# EAGLE design LidHeater_NTC_withDril (EAGLE 6.5.0)
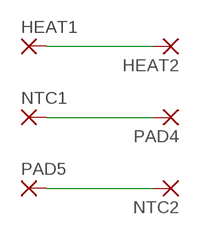
[diagram p0: schematic, sheet 1]

## Parts
HEAT1  SMD5  [SMD2,54-5,08]
HEAT2  SMD5  [SMD2,54-5,08]
NTC1  SMD5  [SMD2,54-5,08]
NTC2  SMD5  [SMD2,54-5,08]
PAD4  SMD5  [SMD2,54-5,08]
PAD5  SMD5  [SMD2,54-5,08]

## Nets
N$1: HEAT1.1(P) HEAT2.1(P)
N$2: NTC1.1(P) PAD4.1(P)
N$3: NTC2.1(P) PAD5.1(P)

## Library data of the parts
HEAT1 HEAT2 NTC1 NTC2 PAD4 PAD5 = wirepad:SMD5: SMD PAD

## Board
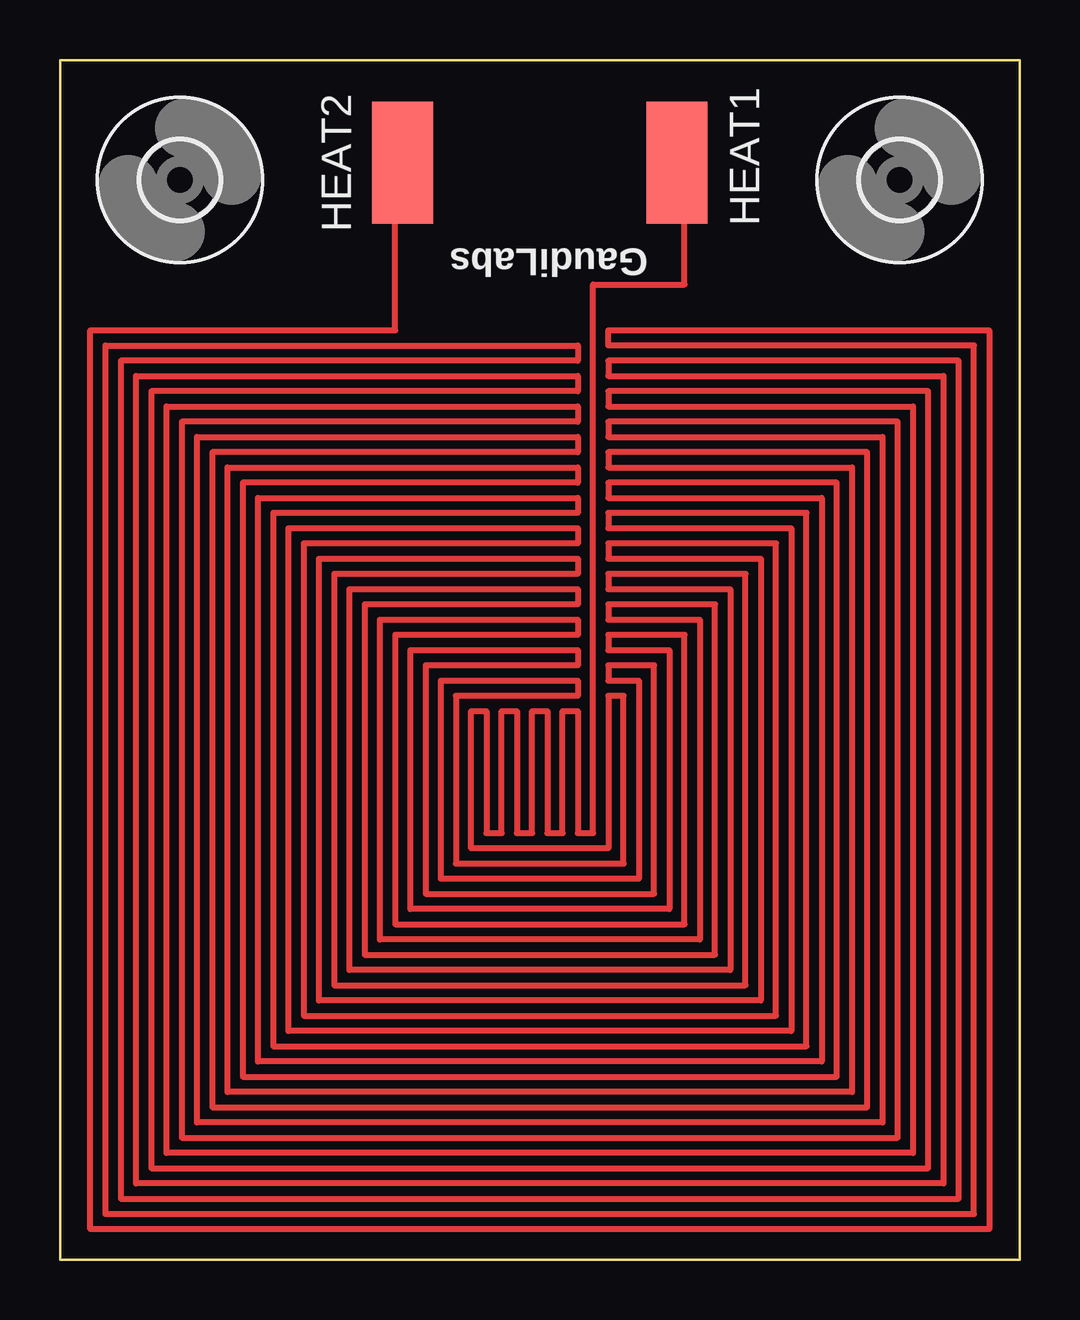
[diagram p1: board, top side]
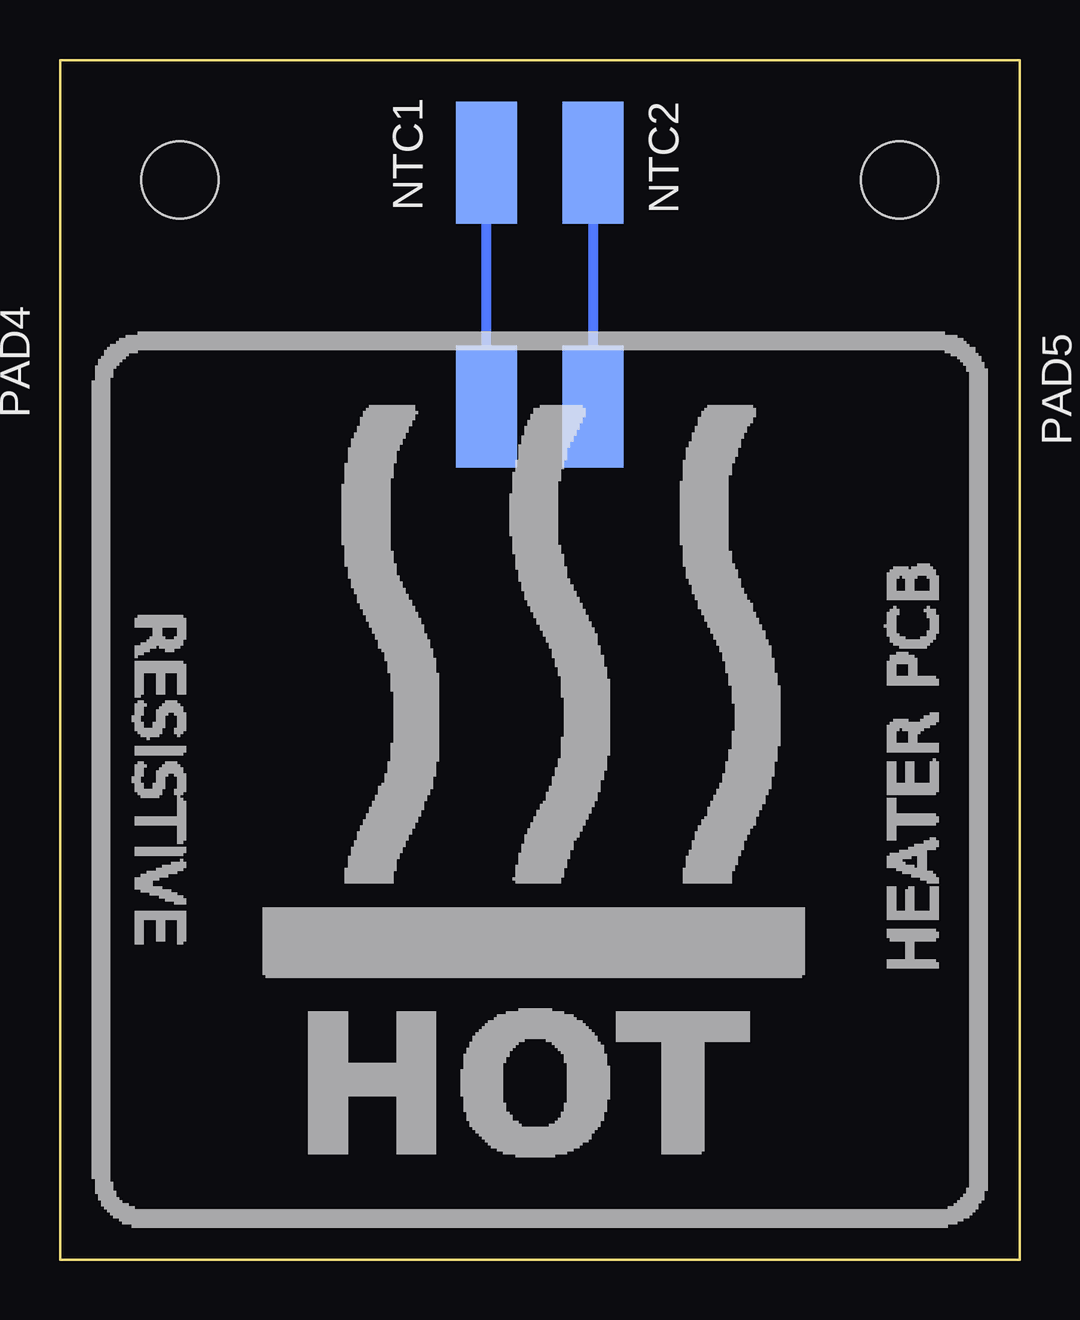
[diagram p2: board, bottom side, seen from below]

Size 40 x 50 mm. Coordinates in mm from the lower left corner, seen from the top.
Outline: 0,0 0,50 40,50 40,0 0,0
Copper layers (1*16): Top 0.035mm / dielectric 1.5mm / Bottom 0.035mm
Design rules "default *": minimum track width 8mil, minimum drill 24mil, track to track 8mil, track to pad 8mil, pad to pad 8mil, via to via 8mil, smd to smd 8mil, copper to edge 40mil, drill to drill 8mil, minimum pad ring 10mil, minimum via ring 8mil, stop-mask expansion 4mil, vias tented up to drill 0mil, thermal gap 10mil

### Footprints (pad centres in the part's own frame; a part is rotated, then mirrored left to right if it is on the bottom)
SMD2,54-5,08 = smd 2.54 x 5.08: 1 0,0
3,2 = hole 3.2: 0,0

### Placement (x,y rotation side)
HEAT1  25.72,45.72 0 top
HEAT2  14.29,45.72 0 top
NTC1  22.23,45.72 0 bottom
NTC2  17.78,45.72 0 bottom
PAD4  22.23,35.56 0 bottom
PAD5  17.78,35.56 0 bottom
U$1  [3,2]  5,45 0 top
U$2  [3,2]  35,45 0 top

### Tracks (layer width: path | path; a pad name or v marks a point on that pad's centre or on a via)
N$1
  Top 0.25: HEAT2.1 13.97,45.72 13.97,38.73 1.27,38.73 1.27,1.27 38.73,1.27 38.73,38.73 22.86,38.73 22.86,38.1 38.1,38.1 38.1,1.91 1.91,1.91 1.91,38.1 21.59,38.1 21.59,37.47 2.54,37.47 2.54,2.54 37.47,2.54 37.47,37.47 22.86,37.47 22.86,36.83 36.83,36.83 36.83,3.17 3.17,3.17 3.17,36.83 21.59,36.83 21.59,36.2 3.81,36.2 3.81,3.81 36.2,3.81 36.2,36.2 22.86,36.2 22.86,35.56 35.56,35.56 35.56,4.45 4.45,4.45 4.45,35.56 21.59,35.56 21.59,34.92 5.08,34.92 5.08,5.08 34.92,5.08 34.92,34.92 22.86,34.92 22.86,34.29 34.29,34.29 34.29,5.71 5.71,5.71 5.71,34.29 21.59,34.29 21.59,33.66 6.35,33.66 6.35,6.35 33.66,6.35 33.66,33.66 22.86,33.66 22.86,33.02 33.02,33.02 33.02,6.99 6.99,6.99 6.99,33.02 21.59,33.02 21.59,32.38 7.62,32.38 7.62,7.62 32.38,7.62 32.38,32.38 22.86,32.38 22.86,31.75 31.75,31.75 31.75,8.26 8.26,8.26 8.26,31.75 21.59,31.75 21.59,31.11 8.89,31.11 8.89,8.89 31.11,8.89 31.11,31.11 22.86,31.11 22.86,30.48 30.48,30.48 30.48,9.53 9.53,9.53 9.53,30.48 21.59,30.48 21.59,29.84 10.16,29.84 10.16,10.16 29.84,10.16 29.84,29.84 22.86,29.84 22.86,29.21 29.21,29.21 29.21,10.79 10.79,10.79 10.79,29.21 21.59,29.21 21.59,28.57 11.43,28.57 11.43,11.43 28.57,11.43 28.57,28.57 22.86,28.57 22.86,27.94 27.94,27.94 27.94,12.06 12.06,12.06 12.06,27.94 21.59,27.94 21.59,27.3 12.7,27.3 12.7,12.7 27.3,12.7 27.3,27.3 22.86,27.3 22.86,26.67 26.67,26.67 26.67,13.34 13.34,13.34 13.34,26.67 21.59,26.67 21.59,26.04 13.97,26.04 13.97,13.97 26.04,13.97 26.04,26.04 22.86,26.04 22.86,25.4 25.4,25.4 25.4,14.61 14.61,14.61 14.61,25.4 21.59,25.4 21.59,24.77 15.24,24.77 15.24,15.24 24.77,15.24 24.77,24.77 22.86,24.77 22.86,24.13 24.13,24.13 24.13,15.88 15.88,15.88 15.88,24.13 21.59,24.13 21.59,23.5 16.51,23.5 16.51,16.51 23.5,16.51 23.5,23.5 22.86,23.5 22.86,17.14 17.14,17.14 17.14,22.86 17.78,22.86 17.78,17.78 18.41,17.78 18.41,22.86 19.05,22.86 19.05,17.78 19.68,17.78 19.68,22.86 20.32,22.86 20.32,17.78 20.95,17.78 20.95,22.86 21.59,22.86 21.59,17.78 22.23,17.78 22.23,40.64 26.04,40.64 26.04,43.81 25.72,43.81 HEAT1.1
N$2
  Bottom 0.406: PAD4.1 NTC1.1
N$3
  Bottom 0.406: NTC2.1 PAD5.1

### Text on the board
tPlace: GaudiLabs